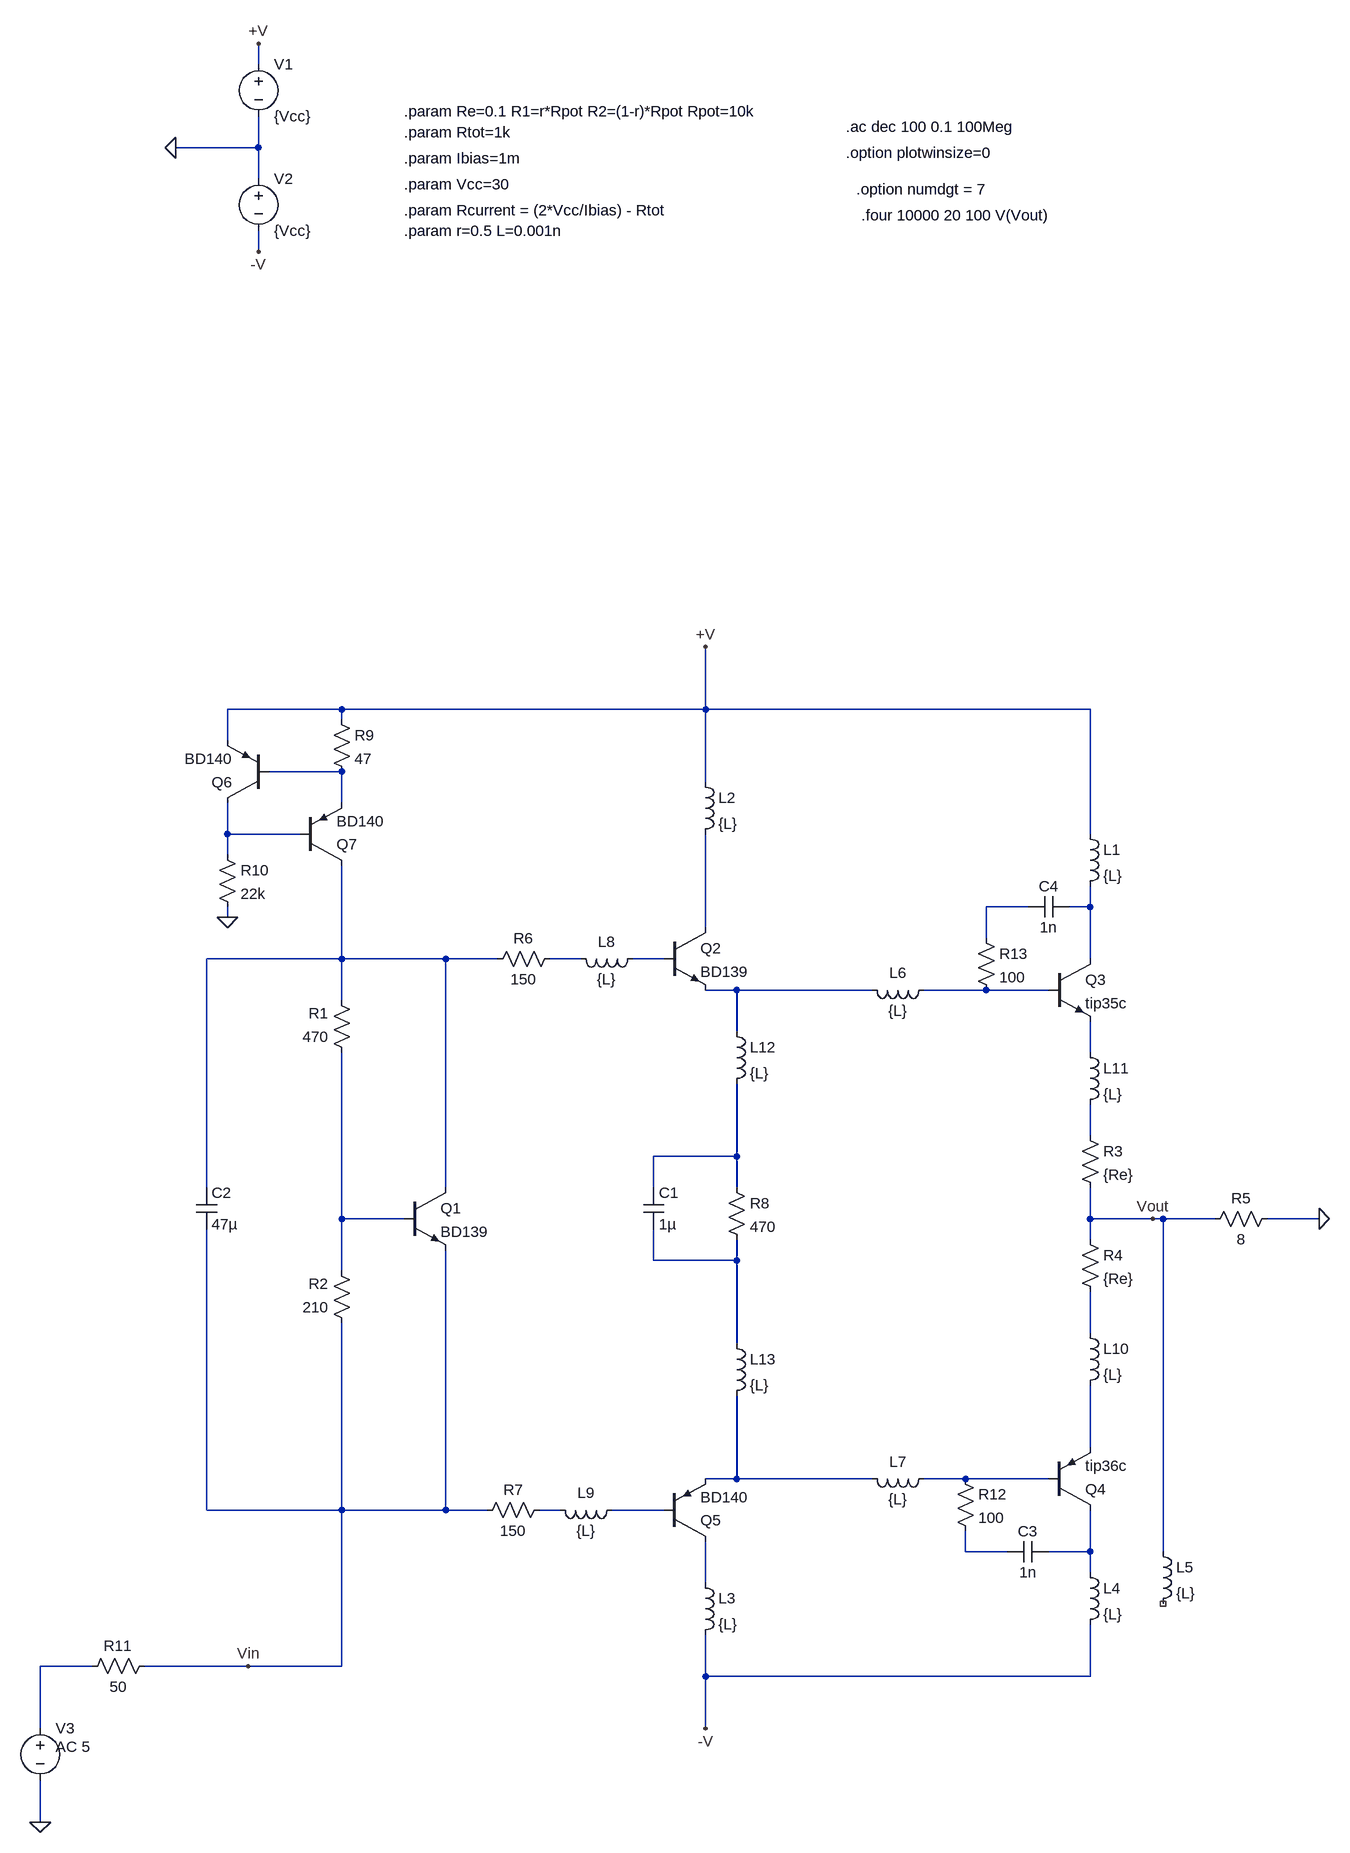
[diagram p0: schematic Draft1.asc]
Draft1.asc, the LTspice schematic file:
Version 4
SHEET 1 880 1300
WIRE -880 -1424 -880 -1456
WIRE -880 -1296 -880 -1344
WIRE -880 -1296 -1008 -1296
WIRE -880 -1248 -880 -1296
WIRE -880 -1136 -880 -1168
WIRE -752 -432 -928 -432
WIRE -192 -432 -192 -528
WIRE -192 -432 -752 -432
WIRE 400 -432 -192 -432
WIRE -752 -416 -752 -432
WIRE -928 -384 -928 -432
WIRE -752 -336 -864 -336
WIRE -192 -320 -192 -432
WIRE -752 -288 -752 -336
WIRE -928 -240 -928 -288
WIRE -816 -240 -928 -240
WIRE 400 -240 400 -432
WIRE -928 -208 -928 -240
WIRE 304 -128 240 -128
WIRE 400 -128 400 -160
WIRE 400 -128 368 -128
WIRE -928 -112 -928 -128
WIRE -192 -96 -192 -240
WIRE 240 -80 240 -128
WIRE -752 -48 -752 -192
WIRE -752 -48 -960 -48
WIRE -592 -48 -752 -48
WIRE -512 -48 -592 -48
WIRE -384 -48 -432 -48
WIRE -256 -48 -304 -48
WIRE 400 -48 400 -128
WIRE -144 0 -192 0
WIRE 64 0 -144 0
WIRE 240 0 144 0
WIRE 336 0 240 0
WIRE -752 16 -752 -48
WIRE -144 64 -144 0
WIRE 400 96 400 48
WIRE 400 224 400 176
WIRE -144 256 -144 144
WIRE -144 256 -272 256
WIRE -960 304 -960 -48
WIRE -592 304 -592 -48
WIRE -272 304 -272 256
WIRE -144 304 -144 256
WIRE -752 352 -752 96
WIRE -656 352 -752 352
WIRE 400 352 400 304
WIRE 496 352 400 352
WIRE 512 352 496 352
WIRE 592 352 512 352
WIRE 752 352 672 352
WIRE 400 384 400 352
WIRE -272 416 -272 368
WIRE -144 416 -144 384
WIRE -144 416 -272 416
WIRE -752 432 -752 352
WIRE 400 528 400 464
WIRE -144 544 -144 416
WIRE 400 704 400 608
WIRE -144 752 -144 624
WIRE -144 752 -192 752
WIRE 64 752 -144 752
WIRE 208 752 144 752
WIRE 336 752 208 752
WIRE -960 800 -960 368
WIRE -752 800 -752 512
WIRE -752 800 -960 800
WIRE -592 800 -592 400
WIRE -592 800 -752 800
WIRE -528 800 -592 800
WIRE -416 800 -448 800
WIRE -256 800 -336 800
WIRE 208 864 208 832
WIRE 272 864 208 864
WIRE 400 864 400 800
WIRE 400 864 336 864
WIRE 512 864 512 352
WIRE 400 896 400 864
WIRE -192 912 -192 848
WIRE -1136 1040 -1216 1040
WIRE -896 1040 -1056 1040
WIRE -752 1040 -752 800
WIRE -752 1040 -896 1040
WIRE -192 1056 -192 992
WIRE 400 1056 400 976
WIRE 400 1056 -192 1056
WIRE -1216 1136 -1216 1040
WIRE -192 1136 -192 1056
WIRE -1216 1280 -1216 1216
FLAG -192 -528 +V
FLAG -192 1136 -V
FLAG -1008 -1296 0
FLAG -880 -1456 +V
FLAG -880 -1136 -V
FLAG 752 352 0
FLAG 496 352 Vout
FLAG -928 -112 0
FLAG -1216 1280 0
FLAG -896 1040 Vin
SYMBOL res -736 112 R180
WINDOW 0 36 76 Left 2
WINDOW 3 36 40 Left 2
SYMATTR InstName R1
SYMATTR Value 470
SYMBOL res -736 528 R180
WINDOW 0 36 76 Left 2
WINDOW 3 36 40 Left 2
SYMATTR InstName R2
SYMATTR Value 210
SYMBOL npn -656 304 R0
SYMATTR InstName Q1
SYMATTR Value BD139
SYMBOL npn -256 -96 R0
SYMATTR InstName Q2
SYMATTR Value BD139
SYMBOL npn 336 -48 R0
SYMATTR InstName Q3
SYMATTR Value tip35c
SYMBOL pnp 336 800 M180
SYMATTR InstName Q4
SYMATTR Value tip36c
SYMBOL pnp -256 848 M180
SYMATTR InstName Q5
SYMATTR Value BD140
SYMBOL res 384 208 R0
SYMATTR InstName R3
SYMATTR Value {Re}
SYMBOL res 384 368 R0
SYMATTR InstName R4
SYMATTR Value {Re}
SYMBOL voltage -880 -1440 R0
WINDOW 123 0 0 Left 0
WINDOW 39 0 0 Left 0
SYMATTR InstName V1
SYMATTR Value {Vcc}
SYMBOL voltage -880 -1264 R0
WINDOW 123 0 0 Left 0
WINDOW 39 0 0 Left 0
SYMATTR InstName V2
SYMATTR Value {Vcc}
SYMBOL res 688 336 R90
WINDOW 0 0 56 VBottom 2
WINDOW 3 32 56 VTop 2
SYMATTR InstName R5
SYMATTR Value 8
SYMBOL res -416 -64 R90
WINDOW 0 0 56 VBottom 2
WINDOW 3 32 56 VTop 2
SYMATTR InstName R6
SYMATTR Value 150
SYMBOL res -432 784 R90
WINDOW 0 0 56 VBottom 2
WINDOW 3 32 56 VTop 2
SYMATTR InstName R7
SYMATTR Value 150
SYMBOL res -160 288 R0
SYMATTR InstName R8
SYMATTR Value 470
SYMBOL cap -288 304 R0
SYMATTR InstName C1
SYMATTR Value 1µ
SYMBOL cap -976 304 R0
SYMATTR InstName C2
SYMATTR Value 47µ
SYMBOL pnp -864 -288 R180
SYMATTR InstName Q6
SYMATTR Value BD140
SYMBOL res -768 -432 R0
SYMATTR InstName R9
SYMATTR Value 47
SYMBOL pnp -816 -192 M180
SYMATTR InstName Q7
SYMATTR Value BD140
SYMBOL res -944 -224 R0
SYMATTR InstName R10
SYMATTR Value 22k
SYMBOL ind 384 -256 R0
SYMATTR InstName L1
SYMATTR Value {L}
SYMBOL ind -208 -336 R0
SYMATTR InstName L2
SYMATTR Value {L}
SYMBOL ind -208 896 R0
SYMATTR InstName L3
SYMATTR Value {L}
SYMBOL ind 384 880 R0
SYMATTR InstName L4
SYMATTR Value {L}
SYMBOL ind 496 848 R0
SYMATTR InstName L5
SYMATTR Value {L}
SYMBOL ind 160 -16 R90
WINDOW 0 5 56 VBottom 2
WINDOW 3 32 56 VTop 2
SYMATTR InstName L6
SYMATTR Value {L}
SYMBOL ind 160 736 R90
WINDOW 0 5 56 VBottom 2
WINDOW 3 32 56 VTop 2
SYMATTR InstName L7
SYMATTR Value {L}
SYMBOL ind -288 -64 R90
WINDOW 0 5 56 VBottom 2
WINDOW 3 32 56 VTop 2
SYMATTR InstName L8
SYMATTR Value {L}
SYMBOL ind -320 784 R90
WINDOW 0 5 56 VBottom 2
WINDOW 3 32 56 VTop 2
SYMATTR InstName L9
SYMATTR Value {L}
SYMBOL voltage -1216 1120 R0
WINDOW 123 24 44 Left 2
WINDOW 39 0 0 Left 0
SYMATTR Value2 AC 5
SYMATTR InstName V3
SYMATTR Value ""
SYMBOL res -1040 1024 R90
WINDOW 0 0 56 VBottom 2
WINDOW 3 32 56 VTop 2
SYMATTR InstName R11
SYMATTR Value 50
SYMBOL ind 384 512 R0
SYMATTR InstName L10
SYMATTR Value {L}
SYMBOL ind 384 80 R0
SYMATTR InstName L11
SYMATTR Value {L}
SYMBOL ind -160 48 R0
SYMATTR InstName L12
SYMATTR Value {L}
SYMBOL ind -160 528 R0
SYMATTR InstName L13
SYMATTR Value {L}
SYMBOL res 192 736 R0
SYMATTR InstName R12
SYMATTR Value 100
SYMBOL cap 336 848 R90
WINDOW 0 0 32 VBottom 2
WINDOW 3 32 32 VTop 2
SYMATTR InstName C3
SYMATTR Value 1n
SYMBOL res 224 -96 R0
SYMATTR InstName R13
SYMATTR Value 100
SYMBOL cap 368 -144 R90
WINDOW 0 0 32 VBottom 2
WINDOW 3 32 32 VTop 2
SYMATTR InstName C4
SYMATTR Value 1n
TEXT -656 -1320 Left 2 !.param Rtot=1k
TEXT -656 -1280 Left 2 !.param Ibias=1m
TEXT -656 -1240 Left 2 !.param Vcc=30
TEXT -656 -1200 Left 2 !.param Rcurrent = (2*Vcc/Ibias) - Rtot
TEXT 24 -1328 Left 2 !.ac dec 100 0.1 100Meg
TEXT 24 -1288 Left 2 !.option plotwinsize=0
TEXT 40 -1232 Left 2 !.option numdgt = 7
TEXT 48 -1192 Left 2 !.four 10000 20 100 V(Vout)
TEXT -656 -1352 Left 2 !.param Re=0.1 R1=r*Rpot R2=(1-r)*Rpot Rpot=10k
TEXT -656 -1168 Left 2 !.param r=0.5 L=0.001n

The netlist it stands for:
* Draft1.asc
R1 N014 N006 470
R2 Vin N014 210
Q1 N006 N014 Vin 0 BD139
Q2 N005 N008 N009 0 BD139
Q3 N004 N010 N011 0 tip35c
Q4 N023 N019 N017 0 tip36c
Q5 N024 N021 N018 0 BD140
R3 N012 Vout {Re}
R4 Vout N016 {Re}
V1 +V 0 {Vcc}
V2 0 -V {Vcc}
R5 0 Vout 8
R6 N007 N006 150
R7 N020 Vin 150
R8 N013 N015 470
C1 N013 N015 1µ
C2 N006 Vin 47µ
Q6 N002 N001 +V 0 BD140
R9 +V N001 47
Q7 N006 N002 N001 0 BD140
R10 N002 0 22k
L1 +V N004 {L}
L2 +V N005 {L}
L3 N024 -V {L}
L4 N023 -V {L}
L5 Vout NC_01 {L}
L6 N010 N009 {L}
L7 N019 N018 {L}
L8 N008 N007 {L}
L9 N021 N020 {L}
V3 N025 0 AC 5
R11 Vin N025 50
L10 N016 N017 {L}
L11 N011 N012 {L}
L12 N009 N013 {L}
L13 N015 N018 {L}
R12 N019 N022 100
C3 N023 N022 1n
R13 N003 N010 100
C4 N004 N003 1n
.model NPN NPN
.model PNP PNP
.lib standard.bjt
.param Rtot=1k
.param Ibias=1m
.param Vcc=30
.param Rcurrent = (2*Vcc/Ibias) - Rtot
.ac dec 100 0.1 100Meg
.option plotwinsize=0
.option numdgt = 7
.four 10000 20 100 V(Vout)
.param Re=0.1 R1=r*Rpot R2=(1-r)*Rpot Rpot=10k
.param r=0.5 L=0.001n
.backanno
.end